# EAGLE design SPY SCH (EAGLE 8.7.0)

## Sheet 1 of 2
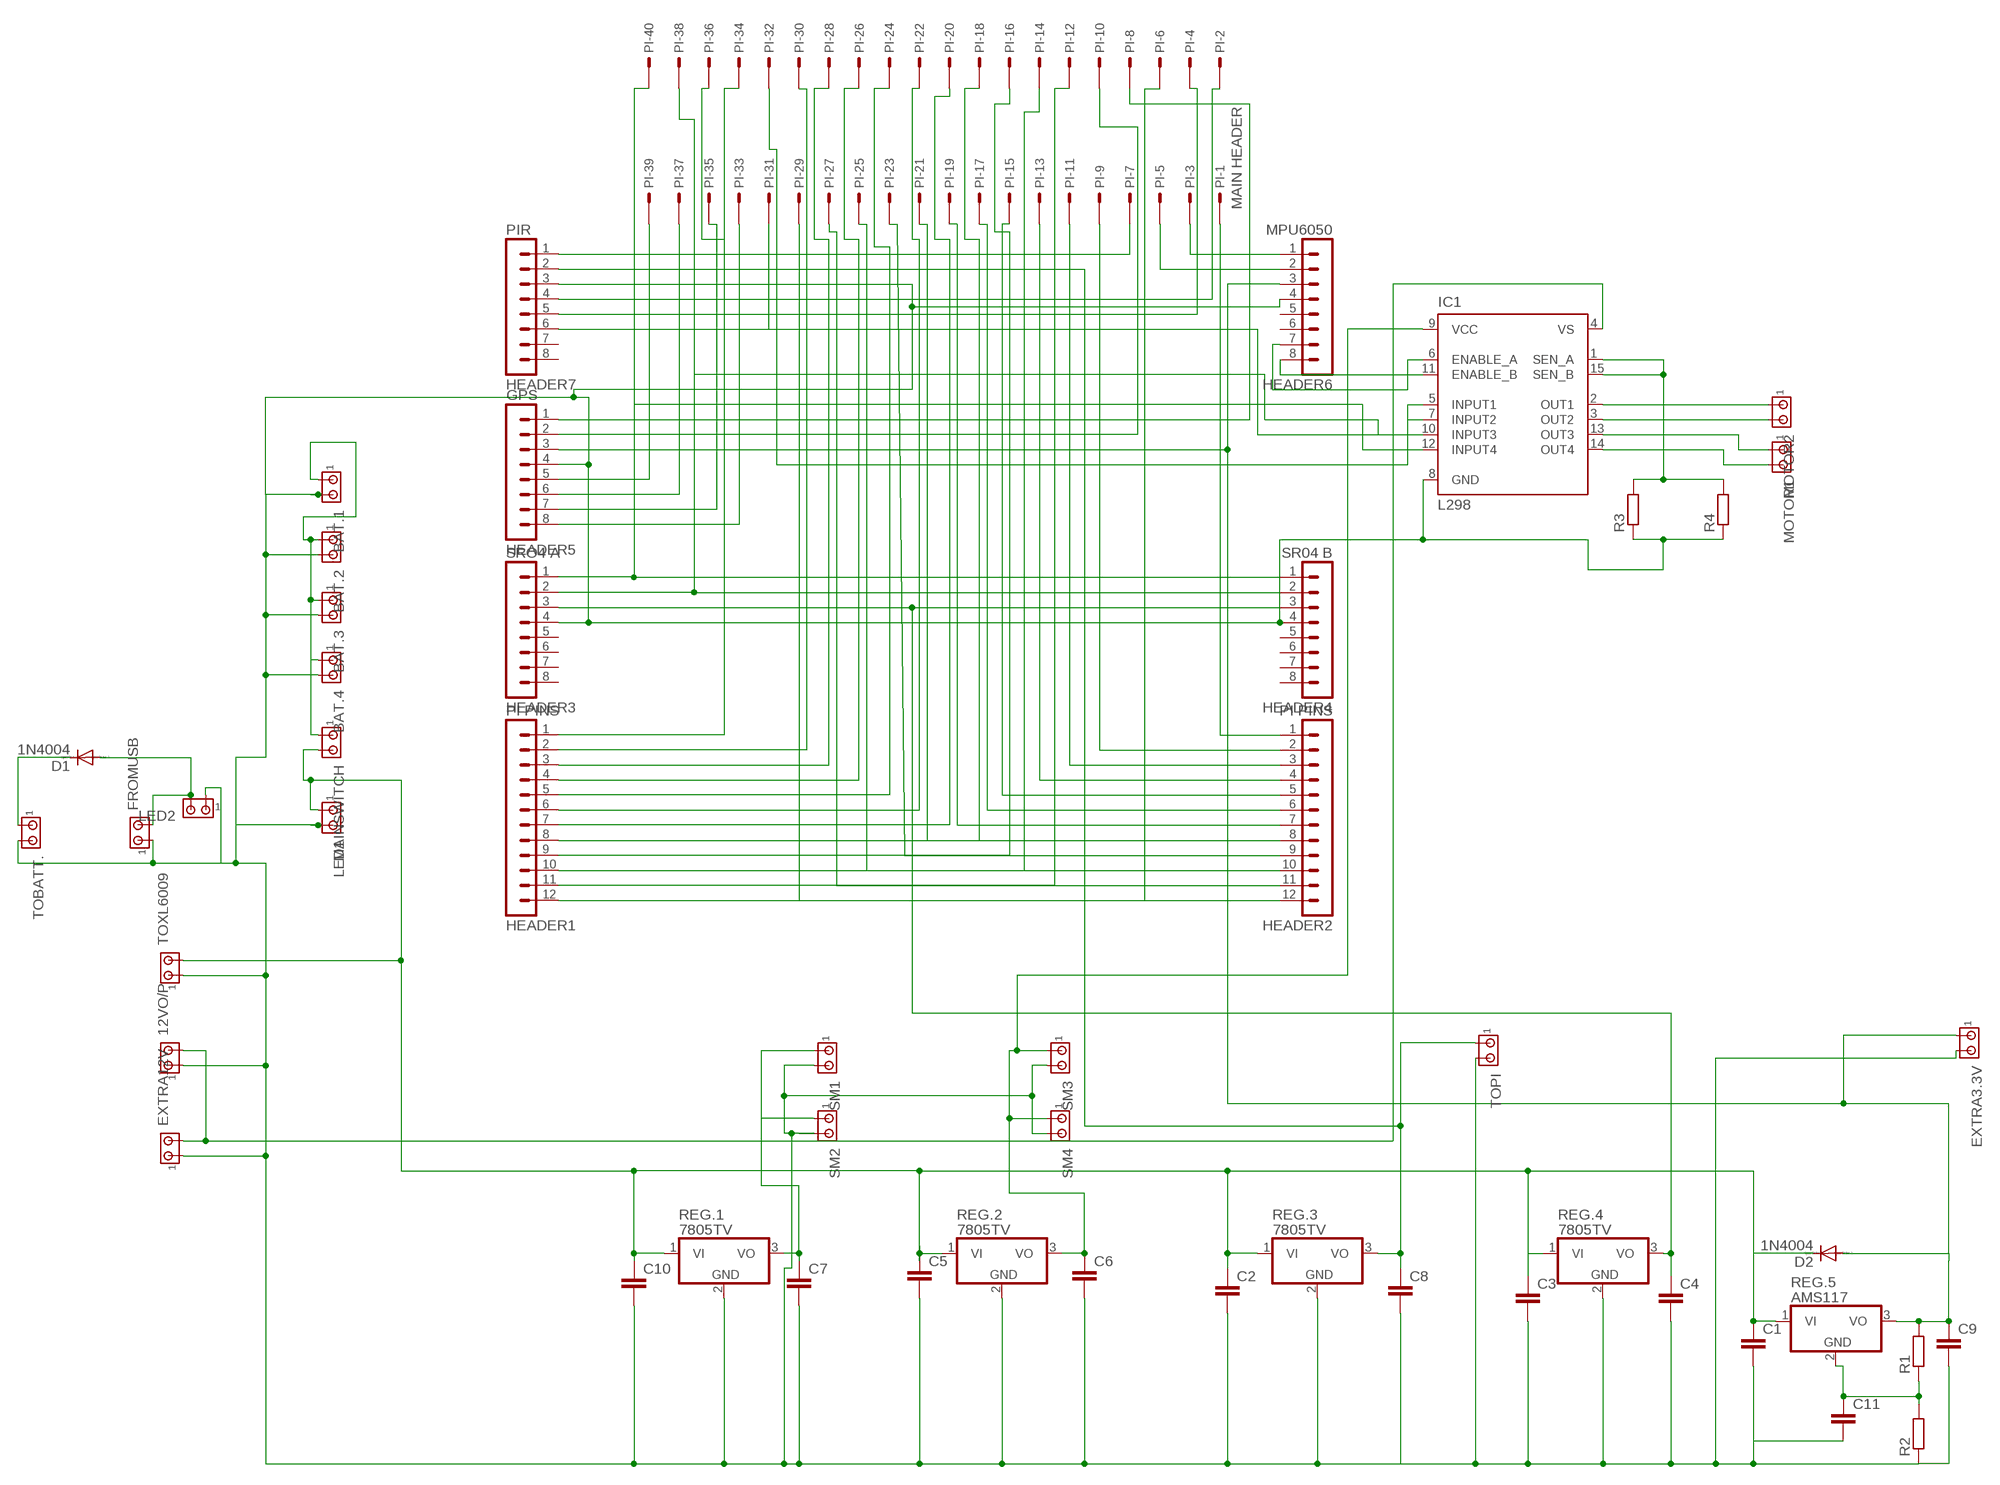
[diagram p0: schematic, sheet 1]

### Parts
12VO/P  MTA02-156  [1X2MTA]
BAT.1  MTA02-156  [1X2MTA]
BAT.2  MTA02-156  [1X2MTA]
BAT.3  MTA02-156  [1X2MTA]
BAT.4  MTA02-156  [1X2MTA]
C1  C2,5-3  [C2.5-3]
C2  C2,5-3  [C2.5-3]
C3  C2,5-3  [C2.5-3]
C4  C2,5-3  [C2.5-3]
C5  C2,5-3  [C2.5-3]
C6  C2,5-3  [C2.5-3]
C7  C2,5-3  [C2.5-3]
C8  C2,5-3  [C2.5-3]
C9  C2,5-3  [C2.5-3]
C10  C2,5-3  [C2.5-3]
C11  C2,5-3  [C2.5-3]
D1  1N4004  [DO41-10]
D2  1N4004  [DO41-10]
EXTRA3.3V  MTA02-156  [1X2MTA]
EXTRA12V  MTA02-156  [1X2MTA]
FROMUSB  MTA02-156  [1X2MTA]
HEADER1  PI PINS  MA12-1W  [MA12-1W]
HEADER2  PI PINS  MA12-1W  [MA12-1W]
HEADER3  SRO4 A  MA08-1  [MA08-1]
HEADER4  SR04 B  MA08-1  [MA08-1]
HEADER5  GPS  MA08-1  [MA08-1]
HEADER6  MPU6050  MA08-1  [MA08-1]
HEADER7  PIR  MA08-1  [MA08-1]
IC1  L298  [MULTIWATT-15]
LED1  MTA02-156  [1X2MTA]
LED2  MTA02-156  [1X2MTA]
MAINSWITCH  MTA02-156  [1X2MTA]
MOTOR1  MTA02-156  [1X2MTA]
MOTOR2  MTA02-156  [1X2MTA]
PI  MAIN HEADER  057-040-1  [057-040-1]
R1  R-EU_0309/12  [0309/12]
R2  R-EU_0309/12  [0309/12]
R3  R-EU_0309/12  [0309/12]
R4  R-EU_0309/12  [0309/12]
REG.1  7805TV  [TO220V]
REG.2  7805TV  [TO220V]
REG.3  7805TV  [TO220V]
REG.4  7805TV  [TO220V]
REG.5  AMS117  7805TV  [TO220V]
SM1  MTA02-156  [1X2MTA]
SM2  MTA02-156  [1X2MTA]
SM3  MTA02-156  [1X2MTA]
SM4  MTA02-156  [1X2MTA]
TOBATT.  MTA02-156  [1X2MTA]
TOPI  MTA02-156  [1X2MTA]
TOXL6009  MTA02-156  [1X2MTA]

### Nets
N$1: HEADER7.1 PI.7
N$2: HEADER7.4 PI.2
N$3: D1.C TOBATT..1
N$4: D1.A FROMUSB.2 LED2.2
N$5: HEADER5.1 PI.8
N$6: HEADER6.2 PI.5
N$8: C8.1 HEADER7.2 REG.3.3(VO) TOPI.1
N$9: C6.1 IC1.9(VCC) REG.2.3(VO) SM3.1 SM4.1
N$10: HEADER5.2 PI.10
N$11: HEADER3.2 HEADER4.2 IC1.10(INPUT3) PI.38
N$12: IC1.7(INPUT2) PI.36
N$13: HEADER3.1 HEADER4.1 IC1.12(INPUT4) PI.40
N$14: HEADER6.1 PI.3
N$15: C1.1 C2.1 C3.1 C5.1 C10.1 D2.C LED1.1 MAINSWITCH.2 REG.1.1(VI) REG.2.1(VI) REG.3.1(VI) REG.4.1(VI) REG.5.1(VI) TOXL6009.2
N$16: BAT.1.1 BAT.2.1 BAT.3.1 BAT.4.1 MAINSWITCH.1
N$17: C9.1 D2.A EXTRA3.3V.1 HEADER5.3 HEADER6.3 R1.2 REG.5.3(VO)
N$18: HEADER1.1 PI.34
N$19: C4.1 HEADER3.3 HEADER4.3 REG.4.3(VO)
N$20: C7.1 REG.1.3(VO) SM1.1 SM2.1
N$21: IC1.5(INPUT1) PI.32
N$22: 12VO/P.2 EXTRA12V.2 IC1.4(VS)
N$23: HEADER1.7 PI.20
N$24: HEADER1.2 PI.30
N$25: HEADER1.3 PI.28
N$26: HEADER1.4 PI.26
N$27: HEADER1.5 PI.24
N$28: HEADER1.6 PI.22
N$29: HEADER1.8 PI.18
N$30: HEADER1.9 PI.16
N$31: HEADER1.10 PI.14
N$32: HEADER1.11 PI.12
N$33: HEADER1.12 PI.6
N$34: HEADER2.1 PI.1
N$35: HEADER2.2 PI.9
N$36: HEADER2.3 PI.11
N$37: HEADER2.4 PI.13
N$38: HEADER2.5 PI.15
N$39: HEADER2.7 PI.19
N$40: HEADER2.8 PI.21
N$41: HEADER2.9 PI.23
N$42: HEADER2.6 PI.17
N$43: HEADER2.10 PI.25
N$44: HEADER2.11 PI.27
N$45: HEADER2.12 PI.29
N$46: HEADER7.5 PI.4
N$47: HEADER6.8 IC1.11(ENABLE_B)
N$48: HEADER7.6 PI.31
N$49: HEADER5.5 PI.39
N$50: HEADER5.6 PI.37
N$51: HEADER5.7 PI.35
N$52: HEADER5.8 PI.33
N$53: C11.1 R1.1 R2.2 REG.5.2(GND)
N$54: 12VO/P.1 BAT.1.2 BAT.2.2 BAT.3.2 BAT.4.2 C1.2 C2.2 C3.2 C4.2 C5.2 C6.2 C7.2 C8.2 C9.2 C10.2 C11.2 EXTRA3.3V.2 EXTRA12V.1 FROMUSB.1 HEADER3.4 HEADER4.4 HEADER5.4 HEADER6.4 HEADER7.3 IC1.8(GND) LED1.2 LED2.1 R2.1 R3.1 R4.1 REG.1.2(GND) REG.2.2(GND) REG.3.2(GND) REG.4.2(GND) SM1.2 SM2.2 SM3.2 SM4.2 TOBATT..2 TOPI.2 TOXL6009.1
N$55: IC1.1(SEN_A) IC1.15(SEN_B) R3.2 R4.2
N$57: IC1.2(OUT1) MOTOR2.1
N$58: IC1.3(OUT2) MOTOR2.2
N$59: IC1.13(OUT3) MOTOR1.1
N$60: IC1.14(OUT4) MOTOR1.2
N$61: HEADER6.7 IC1.6(ENABLE_A)
Unconnected: HEADER3.5 HEADER3.6 HEADER3.7 HEADER3.8 HEADER4.5 HEADER4.6 HEADER4.7 HEADER4.8 HEADER6.5 HEADER6.6 HEADER7.7 HEADER7.8

## Sheet 2 of 2

## Library data of the parts
12VO/P BAT.1-BAT.4 EXTRA3.3V EXTRA12V FROMUSB LED1 LED2 MAINSWITCH MOTOR1 MOTOR2 SM1-SM4 TOBATT. TOPI TOXL6009 = con-amp:MTA02-156: AMP connector
C1-C11 = capacitor-wima:C: CAPACITOR naming: grid - package width
D1 D2 = diode:1N4004: DIODE general purpose rectifier, 1 A
HEADER1 HEADER2 = con-lstb:MA12-1W: PIN HEADER; OC_FARNELL: unknown; OC_NEWARK: unknown
HEADER3-HEADER7 = con-lstb:MA08-1: PIN HEADER; OC_FARNELL: unknown; OC_NEWARK: unknown
IC1 = st-microelectronics:L298: DUAL FULL-BRIDGE DRIVER; MPN: L298N; OC_FARNELL: 1589425; OC_NEWARK: 32M1527
PI = con-panduit:057-040-: CONNECTOR 40-pin series 057 contact pc board low profile headers; OC_FARNELL: unknown; OC_NEWARK: unknown
R1-R4 = resistor:R-EU_: RESISTOR, European symbol
REG.1-REG.5 = linear:78*: Positive VOLTAGE REGULATOR Source: http://cache.national.com/ds/LM/LM78L05.pdf http://www.fairchildsemi.com/ds/LM/LM7805.pdf

## Board
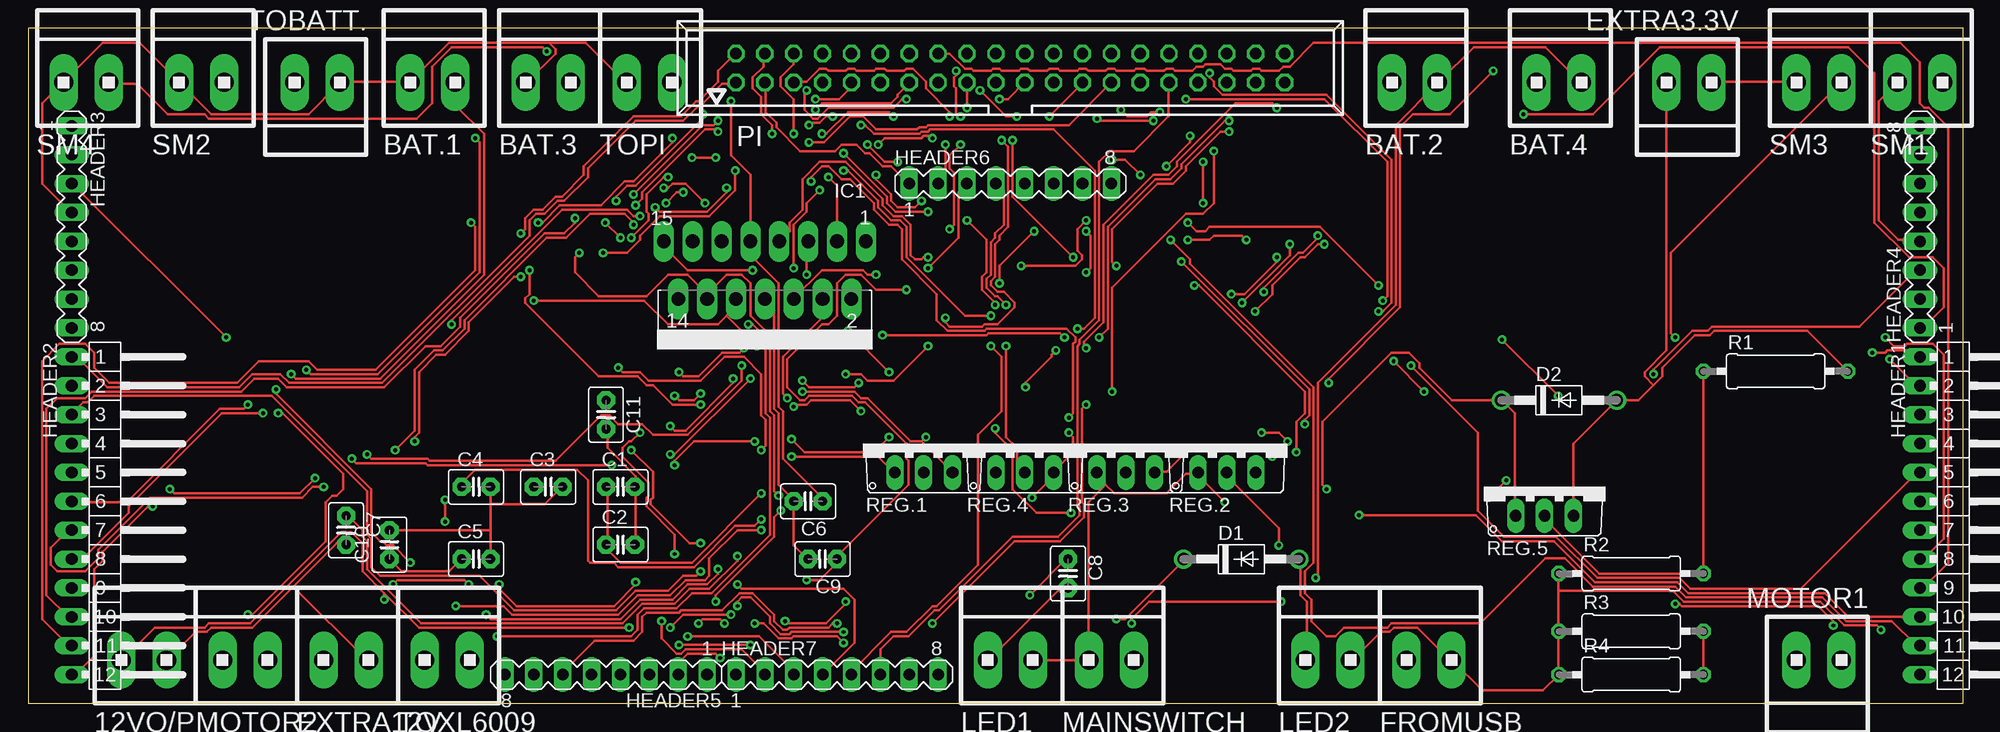
[diagram p1: board, top side]
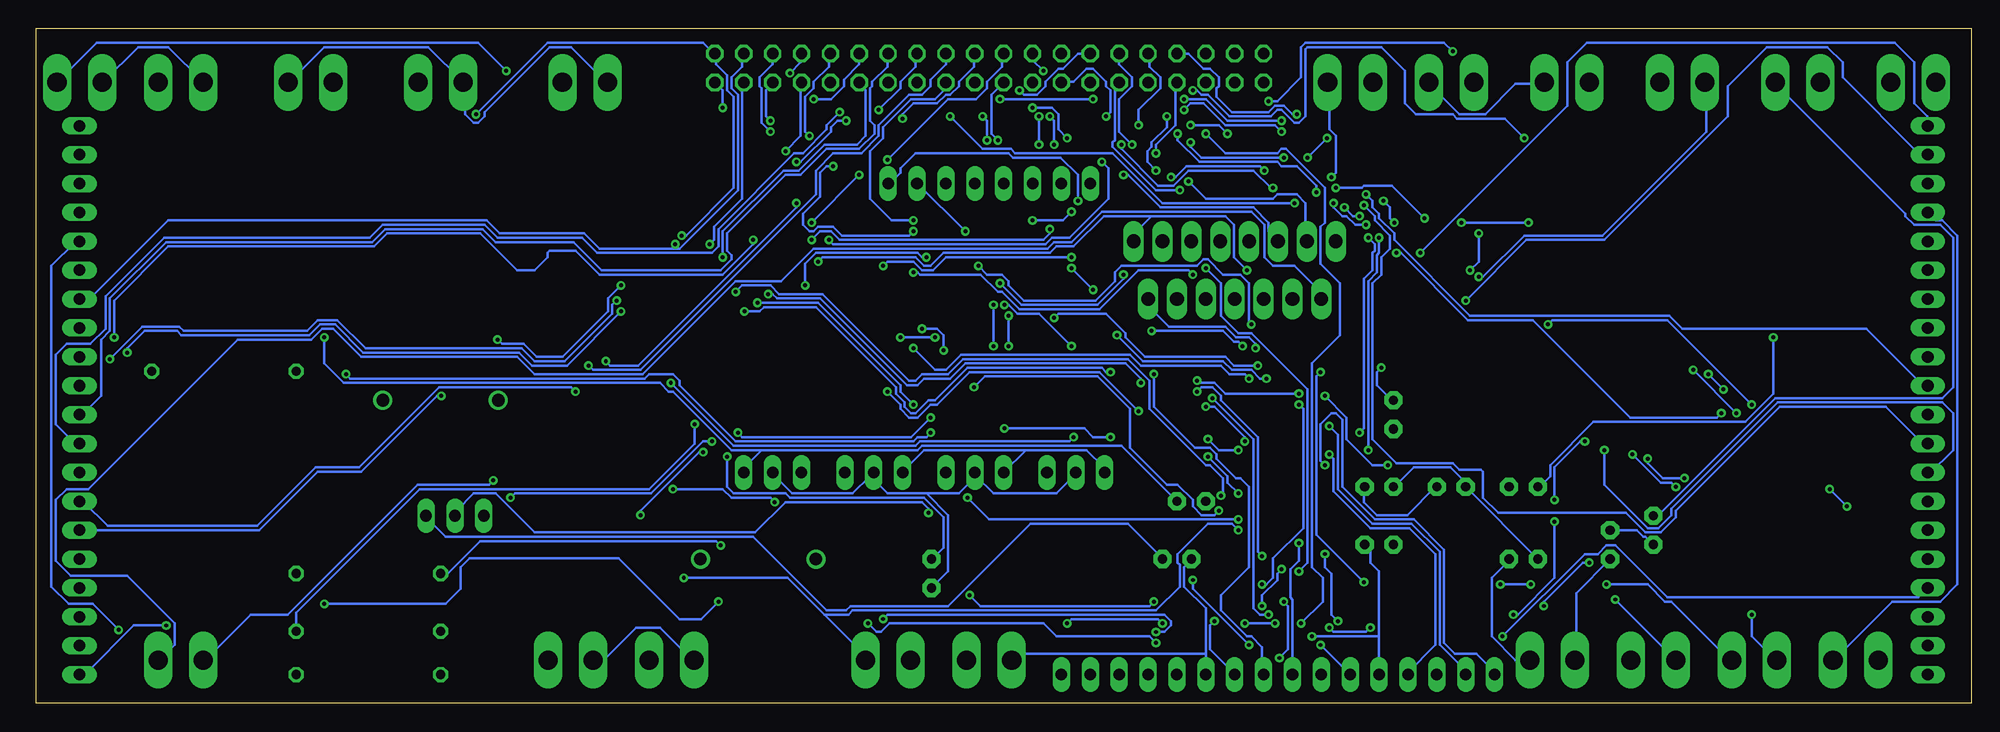
[diagram p2: board, bottom side, seen from below]

Size 170.16 x 59.36 mm. Coordinates in mm from the lower left corner, seen from the top.
Outline: 0,0 170.16,0 170.16,59.36 0,59.36 0,0
Copper layers (1*16): Top 0.035mm / dielectric 1.5mm / Bottom 0.035mm
Design rules "default *": minimum track width 9mil, minimum drill 0.35mm, track to track 6mil, track to pad 6mil, pad to pad 6mil, via to via 6mil, smd to smd 6mil, copper to edge 40mil, drill to drill 6mil, minimum pad ring 10mil, minimum via ring 8mil, stop-mask expansion 4mil, vias tented up to drill 0mil, thermal gap 10mil

### Footprints (pad centres in the part's own frame; a part is rotated, then mirrored left to right if it is on the bottom)
1X2MTA = drill 1.676 long: 1 1.981,0; 2 -1.981,0
C2.5-3 = drill 0.813 pad 1.6 octagon: 1 -1.27,0; 2 1.27,0
DO41-10 = drill 1.118: A 5.08,0; C -5.08,0
MA12-1W = drill 1.016 long: 1 -13.97,0; 2 -11.43,0; 3 -8.89,0; 4 -6.35,0; 5 -3.81,0; 6 -1.27,0; 7 1.27,0; 8 3.81,0; 9 6.35,0; 10 8.89,0; 11 11.43,0; 12 13.97,0
MA08-1 = drill 1.016 long: 1 -8.89,0; 2 -6.35,0; 3 -3.81,0; 4 -1.27,0; 5 1.27,0; 6 3.81,0; 7 6.35,0; 8 8.89,0
MULTIWATT-15 = drill 1.2 long: 1 -8.89,-7.62; 2 -7.62,-2.54; 3 -6.35,-7.62; 4 -5.08,-2.54; 5 -3.81,-7.62; 6 -2.54,-2.54; 7 -1.27,-7.62; 8 0,-2.54; 9 1.27,-7.62; 10 2.54,-2.54; 11 3.81,-7.62; 12 5.08,-2.54; 13 6.35,-7.62; 14 7.62,-2.54; 15 8.89,-7.62
057-040-1 = drill 1 octagon: 1 -24.13,-1.27; 2 -24.13,1.27; 3 -21.59,-1.27; 4 -21.59,1.27; 5 -19.05,-1.27; 6 -19.05,1.27; 7 -16.51,-1.27; 8 -16.51,1.27; 9 -13.97,-1.27; 10 -13.97,1.27; 11 -11.43,-1.27; 12 -11.43,1.27; 13 -8.89,-1.27; 14 -8.89,1.27; 15 -6.35,-1.27; 16 -6.35,1.27; 17 -3.81,-1.27; 18 -3.81,1.27; 19 -1.27,-1.27; 20 -1.27,1.27; 21 1.27,-1.27; 22 1.27,1.27; 23 3.81,-1.27; 24 3.81,1.27; 25 6.35,-1.27; 26 6.35,1.27; 27 8.89,-1.27; 28 8.89,1.27; 29 11.43,-1.27; 30 11.43,1.27; 31 13.97,-1.27; 32 13.97,1.27; 33 16.51,-1.27; 34 16.51,1.27; 35 19.05,-1.27; 36 19.05,1.27; 37 21.59,-1.27; 38 21.59,1.27; 39 24.13,-1.27; 40 24.13,1.27
0309/12 = drill 0.813 octagon: 1 -6.35,0; 2 6.35,0
TO220V = drill 1.016 long: 1 -2.54,-2.54; 2 0,-2.54; 3 2.54,-2.54

### Placement (x,y rotation side)
12VO/P  10.16,3.81 0 top
BAT.1  35.56,54.61 0 top
BAT.2  121.92,54.61 0 top
BAT.3  45.72,54.61 0 top
BAT.4  134.62,54.61 0 top
C1  52.07,19.05 0 top
C2  52.07,13.97 0 top
C3  45.72,19.05 0 top
C4  39.37,19.05 0 top
C5  39.37,12.7 0 top
C6  68.58,17.78 180 top
C7  27.94,15.24 270 top
C8  91.44,11.43 270 top
C9  69.85,12.7 180 top
C10  31.75,13.97 90 top
C11  50.8,25.4 270 top
D1  106.68,12.7 0 top
D2  134.62,26.67 0 top
EXTRA3.3V  146.05,54.61 180 top
EXTRA12V  27.94,3.81 0 top
FROMUSB  123.19,3.81 0 top
HEADER1  166.37,16.51 270 top
HEADER2  3.81,16.51 270 top
HEADER3  3.81,41.91 270 top
HEADER4  166.37,41.91 90 top
HEADER5  50.8,2.54 180 top
HEADER6  86.36,45.72 0 top
HEADER7  71.12,2.54 0 top
IC1  64.77,33.02 180 top
LED1  86.36,3.81 0 top
LED2  114.3,3.81 0 top
MAINSWITCH  95.25,3.81 0 top
MOTOR1  157.48,3.81 180 top
MOTOR2  19.05,3.81 0 top
PI  86.36,55.88 0 top
R1  153.67,29.21 0 top
R2  140.97,11.43 0 top
R3  140.97,6.35 0 top
R4  140.97,2.54 0 top
REG.1  78.74,22.86 0 top
REG.2  105.41,22.86 0 top
REG.3  96.52,22.86 0 top
REG.4  87.63,22.86 0 top
REG.5  133.35,19.05 0 top
SM1  166.37,54.61 0 top
SM2  15.24,54.61 0 top
SM3  157.48,54.61 0 top
SM4  5.08,54.61 0 top
TOBATT.  25.4,54.61 180 top
TOPI  54.61,54.61 0 top
TOXL6009  36.83,3.81 0 top

### Tracks (layer width: path | path; a pad name or v marks a point on that pad's centre or on a via)
N$1  (via drill 0.35)
  Top 0.229: v71.69,48.39 75.5,44.58 75.5,44.01 76.26,43.24 v79.12,43.24 | v82.55,42.48 84.27,40.77 84.27,37.91 83.88,37.53 83.88,36.39 85.03,35.24 v85.03,35.05 | v79.12,31.43 76.07,28.38 73.79,28.38 73.22,28.96 v71.88,28.96
  Bottom 0.229: v71.69,48.39 71.69,49.15 69.98,50.86 69.98,54.48 PI.7 | v79.12,43.24 79.88,42.48 v82.55,42.48 | v85.03,35.05 84.65,35.05 83.88,34.29 81.98,34.29 v79.12,31.43 | v71.88,28.96 71.88,26.1 68.26,22.48 66.93,22.48 66.36,21.91 66.36,21.53 64.64,19.81 64.26,19.81 63.5,19.05 63.5,12 65.98,9.53 65.98,8.19 63.69,5.91 63.31,5.91 62.36,4.95 62.36,2.67 HEADER7.1
N$2  (via drill 0.35)
  Top 0.229: v43.31,41.34 43.69,41.72 43.69,42.67 44.45,43.43 45.21,43.43 46.36,44.58 46.93,44.58 48.83,46.48 48.83,47.24 53.21,51.63 57.4,51.63 58.74,52.96 58.93,52.96 60.64,54.67 60.64,55.63 62.17,57.15 PI.2 | v44.07,38.1 44.07,36.01 43.69,35.62 43.69,35.24 50.17,28.77 53.59,28.77 54.36,28 54.93,28 56.64,26.29 v59.12,26.29 | v62.36,10.48 62.74,10.1 71.69,10.1 72.64,9.14 72.64,5.33 HEADER7.4
  Bottom 0.229: v43.31,41.34 43.31,38.86 v44.07,38.1 | v59.12,26.29 58.74,25.91 58.74,15.43 61.41,12.76 61.41,11.05 61.98,10.48 v62.36,10.48
N$3  (via drill 0.35)
  Top 0.229: v95.69,7.43 96.46,7.43 101.6,12.57 D1.C | v71.69,6.29 67.12,6.29 66.93,6.1 66.17,6.1 65.21,7.05 65.21,7.62 63.5,9.34 62.74,9.34 62.36,8.95 v62.36,8.57 | v60.64,11.81 60.64,11.43 59.69,10.48 57.98,10.48 56.64,9.14 53.78,9.14 52.07,7.43 40.64,7.43 v40.26,7.81 | v36.64,17.91 v36.64,16 | v33.97,23.05 33.97,23.43 34.35,23.81 34.35,29.15 35.88,30.67 36.64,30.67 38.73,32.77 38.73,33.53 42.73,37.53 v43.31,37.53
  Bottom 0.229: v95.69,7.43 95.31,7.81 70.93,7.81 70.36,7.24 70.36,6.86 70.93,6.29 v71.69,6.29 | v62.36,8.57 62.36,9.53 61.02,10.86 61.02,11.43 v60.64,11.81 | v40.26,7.81 39.88,7.81 36.64,11.05 v36.64,16 | v36.64,17.91 36.64,20.77 34.35,23.05 v33.97,23.05 | v43.31,37.53 42.93,37.53 39.31,41.15 32.45,41.15 23.3,50.29 23.3,54.48 TOBATT..1
N$4
  Top 0.229: D1.A 111.89,12.57 111.89,9.53 112.46,8.95 112.46,3.81 LED2.2
  Bottom 0.229: FROMUSB.2 120.27,3.81 117.41,6.67 115.32,6.67 112.46,3.81 LED2.2
N$5  (via drill 0.35)
  Top 0.229: v59.31,51.82 59.31,51.44 53.4,45.53 52.64,45.53 51.69,44.58 v51.69,44.2 | v52.07,40.96 v50.74,42.29 | v53.02,22.29 54.93,20.38 54.93,18.1 54.74,17.91 54.74,17.53 58.17,14.1 v59.12,14.1
  Bottom 0.229: PI.8 68.83,57.15 67.5,55.82 66.93,55.82 66.17,55.05 66.17,54.29 66.36,54.1 66.36,53.34 65.02,52.01 61.79,52.01 61.21,52.58 60.45,52.58 59.69,51.82 v59.31,51.82 | v51.69,44.2 51.12,43.62 51.12,42.67 v50.74,42.29 | v52.07,40.96 52.07,39.62 52.26,39.43 52.26,37.91 53.02,37.15 v53.02,22.29 | v59.12,14.1 59.12,12.57 59.88,11.81 59.88,9.34 59.69,9.14 HEADER5.1
N$6  (via drill 0.35)
  Top 0.229: v81.03,51.63 81.03,52.01 78.93,54.1 78.93,54.67 77.79,55.82 77.22,55.82 77.02,55.63 75.5,55.63 75.31,55.82 74.55,55.82 74.36,55.63 72.83,55.63 72.64,55.82 72.07,55.82 71.88,55.63 70.36,55.63 70.17,55.82 69.6,55.82 68.45,54.67 67.31,54.67 PI.5 | v80.64,49.15 80.64,46.29 80.07,45.72 HEADER6.2
  Bottom 0.229: v81.03,51.63 80.64,51.24 v80.64,49.15
N$8  (via drill 0.35)
  Top 0.229: v66.55,7.24 66.74,7.05 70.17,7.05 71.88,8.76 v71.88,8.95 | v88.08,9.53 91.31,12.76 C8.1 | v109.41,21.72 108.84,22.29 101.98,22.29 100.08,20.38 99.12,20.38 REG.3.3 | v56.26,46.29 55.88,46.29 54.36,44.77 54.36,43.24 54.55,43.05 54.55,42.48 v53.02,40.96 | v53.78,23.81 53.02,23.05 52.83,23.05 52.26,22.48 52.26,21.72 54.55,19.43 54.55,18.29 54.36,18.1 54.36,17.34 56.83,14.86 v56.83,13.14 | v55.69,7.24 55.69,5.71 57.02,4.38 57.4,4.38 57.78,4.76 62.74,4.76 64.83,2.67 HEADER7.2
  Bottom 0.229: v66.55,7.24 66.93,6.86 66.93,4.76 64.83,2.67 HEADER7.2 | v71.88,8.95 72.26,8.57 87.12,8.57 v88.08,9.53 | v109.41,21.72 109.41,19.05 108.84,18.48 104.27,18.48 103.89,18.1 92.08,18.1 90.36,16.38 90.36,13.72 91.31,12.76 C8.1 | v56.26,46.29 55.88,46.67 55.88,49.91 56.45,50.48 56.45,54.48 TOPI.1 | v53.02,40.96 52.45,40.39 52.45,39.81 52.64,39.62 52.64,38.1 53.4,37.34 53.4,24.19 v53.78,23.81 | v56.83,13.14 56.83,12 56.26,11.43 56.26,7.81 v55.69,7.24
N$9  (via drill 0.35)
  Top 0.229: C6.1 69.98,17.91 66.36,21.53 66.36,25.72 65.98,26.1 65.98,36.96 63.5,39.43 IC1.9 63.5,46.48 61.79,48.2 v61.79,52.96 | v45.59,57.34 45.21,57.72 37.21,57.72 35.5,56.01 35.5,52.77 34.16,51.44 15.88,51.44 15.49,51.82 12.26,51.82 9.59,54.48 7.11,54.48 SM4.1 | v144.84,32.19 144.46,32.58 144.46,39.62 159.32,54.48 SM3.1
  Bottom 0.229: 106.36,22.29 107.89,20.77 107.89,20.38 REG.2.3 | 106.36,22.29 92.65,22.29 92.27,22.67 74.74,22.67 C6.1 | v45.59,57.34 46.36,58.1 58.55,58.1 58.93,57.72 58.93,55.05 61.02,52.96 v61.79,52.96 | v144.84,32.19 144.84,29.91 143.13,28.19 115.32,28.19 114.55,27.43 114.17,27.43 109.03,22.29 106.36,22.29
N$10  (via drill 0.35)
  Top 0.229: v73.22,50.86 73.6,50.86 74.36,50.1 78.36,50.1 78.55,50.29 79.12,50.29 79.31,50.48 90.17,50.48 93.79,46.86 93.79,33.91 92.84,32.96 v92.27,32.96 | v90.36,31.05 89.98,30.67 89.98,30.48 87.69,28.19 v87.69,27.81 | v66.17,16.95 65.59,16.38 65.59,14.67 60.45,9.53 v60.45,8.95 | v60.83,4 60.45,4.38 57.98,4.38 57.21,3.62 57.21,2.67 HEADER5.2
  Bottom 0.229: v73.22,50.86 73.22,52.2 71.31,54.1 71.31,55.05 72.26,56.01 72.26,57.15 PI.10 | v92.27,32.96 90.93,32.96 90.36,32.38 v90.36,31.05 | v87.69,27.81 86.74,28.77 76.83,28.77 73.98,25.91 73.98,22.48 70.74,19.24 69.79,19.24 68.45,17.91 68.45,17.34 67.69,16.57 66.55,16.57 v66.17,16.95 | v60.45,8.95 60.07,8.57 60.07,4.76 v60.83,4
N$11  (via drill 0.35)
  Top 0.229: v44.45,35.43 54.17,35.43 56.26,33.34 60.64,33.34 61.41,34.1 | 61.41,34.1 62.17,34.86 62.17,35.43 IC1.10 | v64.07,31.43 61.41,34.1 | v75.69,29.15 v72.07,32.77 | v107.89,34.48 109.41,36.01 109.41,36.77 111.89,39.24 112.27,39.24 113.41,40.39 v113.98,40.39
  Bottom 0.229: v44.45,35.43 39.12,40.77 32.26,40.77 21.4,51.63 21.4,54.29 17.97,57.72 12.64,57.72 11.3,56.39 11.3,55.05 4.64,48.39 3.87,48.39 HEADER3.2 | 113.98,40.01 120.65,40.01 121.98,41.34 129.41,41.34 130.56,42.48 158.56,42.48 165.42,35.62 166.37,35.62 HEADER4.2 | 113.98,40.01 113.6,40.01 108.46,45.15 108.46,53.53 109.03,54.1 109.03,55.05 108.08,56.01 108.08,57.15 PI.38 | v64.07,31.43 64.45,31.81 64.83,31.81 65.79,32.77 v72.07,32.77 | v75.69,29.15 76.07,29.15 76.45,29.53 88.27,29.53 91.12,26.67 91.69,26.67 92.84,25.53 93.22,25.53 93.79,26.1 93.79,26.48 94.55,27.24 94.55,27.81 101.6,34.86 106.17,34.86 106.55,34.48 v107.89,34.48 | 113.98,40.01 v113.98,40.39
N$12  (via drill 0.35)
  Top 0.229: v105.6,50.29 104.84,50.29 101.79,47.24 101.79,46.86 100.65,45.72 99.31,45.72 95.31,41.72 95.31,38.86 v95.69,38.48 | v79.12,39.24 78.74,39.24 78.55,39.05 77.98,39.05 77.6,39.43 77.6,42.1 76.83,42.86 76.07,42.86 75.12,43.81 75.12,44.39 71.88,47.62 69.6,47.62 68.07,46.1 68.07,43.43 66.93,42.29 66.93,41.53 IC1.7
  Bottom 0.229: PI.36 105.41,56.2 106.55,55.05 106.55,54.29 106.36,54.1 106.36,51.05 v105.6,50.29 | v95.69,38.48 95.31,38.86 93.03,38.86 92.27,38.1 91.31,38.1 90.17,39.24 v79.12,39.24
N$13  (via drill 0.35)
  Top 0.229: v48.45,39.62 48.07,39.24 48.07,37.91 50.17,35.81 54.36,35.81 56.26,37.72 57.98,37.72 59.69,36.01 | 59.69,36.01 IC1.12 59.69,35.62 | v131.51,51.82 137.6,51.82 143.51,57.72 160.08,57.72 162.37,55.44 162.37,42.29 165.42,39.24 167.51,39.24 168.47,38.29 168.47,34.86 166.75,33.15 166.37,33.15 HEADER4.1 | 59.69,36.01 61.41,37.72 62.74,37.72 63.5,36.96 63.5,34.1 65.21,32.38 65.21,25.72 65.59,25.34 65.59,18.67 v65.98,18.29 | v108.65,36.2 108.65,36.58 111.7,39.62 112.08,39.62 113.41,40.96 v113.41,41.15
  Bottom 0.229: v48.45,39.62 35.5,52.58 35.5,56.39 33.78,58.1 6.73,58.1 5.02,56.39 5.02,52.77 3.87,51.63 3.87,50.86 HEADER3.1 | v131.51,51.82 125.22,58.1 111.51,58.1 110.55,57.15 PI.40 110.36,57.15 110.36,56.2 109.41,55.24 109.41,53.91 108.84,53.34 108.84,45.34 113.03,41.15 v113.41,41.15 | v65.98,18.29 65.79,18.48 65.79,19.81 66.93,20.95 67.31,20.95 72.26,25.91 72.26,28.38 74.17,30.29 88.65,30.29 89.98,28.96 92.27,28.96 92.84,28.38 93.41,28.38 101.03,36.01 104.84,36.01 105.6,36.77 108.08,36.77 v108.65,36.2
N$14
  Top 0.229: PI.3 64.83,54.48 64.83,52.01 65.79,51.05 65.79,50.67 67.88,48.58 70.93,48.58 71.5,49.15 72.83,49.15 73.6,48.39 73.98,48.39 75.12,47.24 75.88,47.24 77.41,45.72 HEADER6.1
N$15  (via drill 0.35)
  Top 0.229: C1.1 50.93,19.05 50.93,14.1 C2.1 50.93,13.91 50.93,13.53 52.07,12.38 58.36,12.38 v64.45,18.48 | C10.1 32.83,11.62 37.02,11.62 C5.1 | REG.5.1 130.75,16.57 130.75,25.53 129.6,26.67 D2.C 125.22,26.67 122.36,29.53 122.36,29.91 121.41,30.86 119.89,30.86 113.79,24.77 113.79,19.24 v114.17,18.86 | 93.22,3.81 LED1.1 | 102.74,20.19 101.79,20.19 100.08,18.48 95.5,18.48 94.74,19.24 | 94.74,19.24 93.98,20 REG.3.1 | 93.22,3.81 93.22,17.72 94.74,19.24 | 93.22,3.81 MAINSWITCH.2 | 102.74,20.19 v105.22,17.72 | 102.74,20.19 REG.2.1 | v67.12,21.72 74.74,21.72 76.07,20.38 REG.1.1
  Bottom 0.229: C1.1 50.74,19.05 49.02,20.77 45.78,20.77 44.45,19.43 C3.1 C5.1 | C10.1 34.73,9.72 34.73,3.81 TOXL6009.2 | 83.12,22.29 77.79,22.29 76.26,20.77 76.26,20.38 REG.1.1 | REG.4.1 83.12,22.29 | 83.12,22.29 92.08,22.29 93.98,20.38 REG.3.1 | v114.17,18.86 109.79,18.86 109.03,18.1 105.6,18.1 v105.22,17.72 | v64.45,18.48 65.41,19.43 65.41,20 v67.12,21.72
N$16  (via drill 0.35)
  Top 0.229: v113.22,11.05 113.41,11.24 113.41,28.19 120.27,35.05 120.27,50.86 123.89,54.48 BAT.2.1 124.08,54.67 127.13,57.72 133.41,57.72 136.46,54.67 BAT.4.1 | v23.11,28.96 23.5,28.57 30.93,28.57 40.07,37.72 40.07,50.1 37.59,52.58 37.59,54.48 BAT.1.1 | v21.78,27.62 21.78,27.24 30.16,18.86 30.16,15.05 30.93,14.29 31.11,14.29 31.5,13.91 32.07,13.91 v33.59,12.38 | v37.59,8.57 41.78,8.57 42.55,7.81 51.88,7.81 53.59,9.53 56.45,9.53 57.78,10.86 59.5,10.86 59.88,11.24 59.88,12.76 62.36,15.24 v64.45,15.24
  Bottom 0.229: BAT.1.1 37.59,54.48 40.07,54.48 42.73,51.82 45.02,51.82 47.69,54.48 BAT.3.1 | 100.84,7.81 104.08,11.05 v113.22,11.05 | 100.84,7.81 97.41,4.38 97.41,3.81 MAINSWITCH.1 | v21.78,27.62 v23.11,28.96 | v33.59,12.38 34.16,12.38 37.59,8.95 v37.59,8.57 | v64.45,15.24 65.02,15.81 67.12,15.81 69.79,13.14 69.79,12.38 69.6,12.19 69.6,10.29 71.69,8.19 98.36,8.19 98.74,7.81 100.84,7.81
N$17  (via drill 0.35)
  Top 0.229: R1.2 156.46,32.77 148.27,32.77 147.89,32.38 146.56,32.38 143.7,29.53 143.7,28.77 142.94,28 | 142.94,28 141.6,26.67 D2.A 135.89,22.86 REG.5.3 | 142.94,28 142.18,28.77 142.18,29.15 144.08,31.05 144.08,54.48 EXTRA3.3V.1 | v63.5,5.14 v57.21,5.14 | v68.45,10.86 69.6,10.86 71.12,12.38 C9.1 71.12,12.95 77.41,19.24 77.41,21.34 77.22,21.53 77.22,22.86 73.6,26.48 73.03,26.48 72.45,27.05 68.64,27.05 68.26,26.67 67.88,26.67 66.74,27.81 66.74,30.29 69.79,33.34 70.36,33.34 71.12,34.1 71.12,36.96 71.88,37.72 73.22,37.72 74.55,36.39 v77.22,36.39 | HEADER6.3 81.79,44.96 81.79,40.96 v79.12,38.29
  Bottom 0.229: v57.21,5.14 HEADER5.3 | v63.5,5.14 68.45,10.1 v68.45,10.86 | v77.22,36.39 v79.12,38.29 | REG.5.3 135.89,16.38 134.18,14.67 107.12,14.67 100.65,8.19 98.93,8.19 98.55,8.57 89.98,8.57 82.74,15.81 74.17,15.81 71.12,12.76 C9.1
N$18  (via drill 0.35)
  Top 0.229: v103.89,55.44 103.89,55.05 104.27,54.67 104.27,54.29 105.03,53.53 114.17,53.53 119.89,47.82 119.89,35.24 119.13,34.48 v118.74,34.48 | v162.18,30.86 163.32,30.86 163.51,31.05 165.8,31.05 HEADER1.1
  Bottom 0.229: v103.89,55.44 102.93,56.39 102.93,57.15 PI.34 | v118.74,34.48 123.51,29.72 126.55,29.72 127.7,30.86 141.41,30.86 143.89,33.34 145.22,33.34 146.18,32.38 157.42,32.38 157.8,32.77 160.66,32.77 162.18,31.24 v162.18,30.86
N$19  (via drill 0.35)
  Top 0.229: v17.4,32.19 3.87,45.72 HEADER3.3 | v91.5,23.81 91.88,23.43 91.88,22.1 90.17,20.38 REG.4.3 90.17,20 v88.27,18.1 | v142.94,28.96 142.94,29.34 146.37,32.77 147.7,32.77 148.08,33.15 161.04,33.15 165.99,38.1 HEADER4.3 | v64.45,16.19 63.88,15.62 62.17,15.62 58.55,12 51.88,12 51.5,12.38 49.4,12.38 49.21,12.57 49.21,19.62 48.26,20.57 39.31,20.57 38.16,19.43 38.16,19.05 C4.1
  Bottom 0.229: v17.4,32.19 17.4,27.24 19.88,24.77 33.21,24.77 37.02,20.95 37.02,20 37.97,19.05 C4.1 | v91.5,23.81 91.88,23.43 92.65,23.43 93.03,23.05 108.65,23.05 113.6,28 113.6,28.38 114.17,28.96 116.27,28.96 116.65,28.57 142.56,28.57 v142.94,28.96 | v64.45,16.19 86.36,16.19 v88.27,18.1
N$20  (via drill 0.35)
  Top 0.229: 78.55,23.05 REG.1.3 | 78.55,23.05 77.6,23.05 73.79,26.86 73.22,26.86 72.64,27.43 v68.07,27.43 | v62.36,12.95 62.36,12.57 59.88,10.1 58.17,10.1 56.83,8.76 53.97,8.76 52.26,7.05 34.54,7.05 29.78,11.81 29.78,14.29 29.4,14.67 29.4,15.24 28.07,16.57 C7.1 | v128.84,55.63 125.03,51.82 121.79,51.82 120.65,50.67 120.65,34.86 114.36,28.57 v114.36,28.19 | 78.55,23.05 v78.93,23.43
  Bottom 0.229: v68.07,27.43 67.69,27.81 66.74,27.81 65.98,27.05 65.98,26.67 62.74,23.43 62.74,13.34 v62.36,12.95 | SM2.1 17.21,54.48 5.78,43.05 5.78,42.86 5.02,42.1 2.73,42.1 1.59,40.96 1.59,27.81 2.54,26.86 17.21,26.86 27.5,16.57 27.88,16.57 C7.1 | v128.84,55.63 131.32,58.1 164.85,58.1 168.28,54.67 SM1.1 | v114.36,28.19 108.84,22.67 92.84,22.67 92.46,23.05 79.31,23.05 v78.93,23.43
N$21  (via drill 0.35)
  Top 0.229: v102.17,49.91 102.17,49.34 v100.08,47.24 | v93.03,41.53 93.41,41.15 93.41,38.29 v93.03,37.91 | v68.45,37.72 68.45,40.58 IC1.5
  Bottom 0.229: v102.17,49.91 102.55,50.29 102.55,53.34 101.79,54.1 101.79,54.67 100.46,56.01 100.46,57.15 PI.32 | v100.08,47.24 100.65,47.24 101.22,46.67 101.22,44.58 102.74,43.05 102.74,42.1 102.17,41.53 101.79,41.53 101.41,41.91 100.08,41.91 99.31,41.15 93.41,41.15 v93.03,41.53 | v93.03,37.91 92.65,37.91 92.46,37.72 87.12,37.72 85.6,36.2 85.22,36.2 83.69,34.67 76.64,34.67 73.22,38.1 68.83,38.1 v68.45,37.72
N$22  (via drill 0.35)
  Top 0.229: v66.74,26.86 66.36,27.24 66.36,30.48 69.79,33.91 69.79,35.43 IC1.4 | v61.79,7.81 57.59,7.81 v56.45,6.67 | v52.83,6.67 34.35,6.67 31.3,9.72 | 31.3,9.72 29.4,11.62 29.4,14.1 28.45,15.05 27.5,15.05 19.5,7.05 15.88,7.05 15.49,6.67 11.11,6.67 8.26,3.81 12VO/P.2 | 31.3,9.72 v31.3,9.14
  Bottom 0.229: v66.74,26.86 63.12,23.24 63.12,8.38 62.55,7.81 v61.79,7.81 | v56.45,6.67 56.07,6.29 53.21,6.29 v52.83,6.67 | v31.3,9.14 25.97,3.81 EXTRA12V.2
N$23  (via drill 0.35)
  Top 0.229: v95.31,47.82 96.46,47.82 v97.79,46.48 | v101.98,42.29 102.74,41.53 103.5,41.53 103.89,41.91 113.6,41.91 v118.74,36.77 | v134.56,27.05 v129.6,32
  Bottom 0.229: v95.31,47.82 89.98,53.15 87.5,53.15 86.55,54.1 86.55,54.67 85.22,56.01 85.22,57.15 PI.20 | v101.98,42.29 v97.79,46.48 | v118.74,36.77 119.89,35.62 119.89,34.48 123.89,30.48 126.17,30.48 127.32,31.62 129.22,31.62 v129.6,32 | v134.56,27.05 134.94,27.05 141.6,20.38 145.41,20.38 150.56,15.24 HEADER1.7
N$24  (via drill 0.35)
  Top 0.229: v101.79,53.15 113.98,53.15 119.51,47.62 119.51,35.81 v119.13,35.43 | v163.7,30.29 165.99,28 166.37,28 HEADER1.2
  Bottom 0.229: PI.30 97.79,56.2 99.12,54.86 99.12,54.29 100.27,53.15 v101.79,53.15 | v119.13,35.43 119.51,35.05 119.51,34.29 123.7,30.1 126.36,30.1 127.51,31.24 141.22,31.24 143.7,33.72 145.41,33.72 146.37,32.77 157.23,32.77 157.61,33.15 160.84,33.15 v163.7,30.29
N$25
  Bottom 0.229: PI.28 95.31,57.15 95.31,56.01 96.65,54.67 96.65,54.29 96.84,54.1 96.84,51.24 96.46,50.86 96.46,50.1 97.79,48.77 100.65,48.77 102.93,46.48 104.27,46.48 109.41,41.34 109.41,39.81 109.03,39.43 109.03,39.05 109.98,38.1 120.46,38.1 122.94,40.58 129.79,40.58 130.94,41.72 139.51,41.72 140.65,40.58 158.75,40.58 163.7,35.62 163.7,32.77 164.47,32 164.47,27.05 165.99,25.53 166.37,25.53 HEADER1.3
N$26  (via drill 0.35)
  Top 0.229: v96.08,52.2 96.65,51.63 98.36,51.63 98.74,52.01 v99.5,52.01
  Bottom 0.229: v96.08,52.2 94.17,54.1 94.17,54.67 92.84,56.01 92.84,57.15 PI.26 | v99.5,52.01 100.65,50.86 100.65,50.48 102.74,48.39 103.5,48.39 110.17,41.72 110.17,40.2 110.74,39.62 120.84,39.62 122.17,40.96 129.6,40.96 130.75,42.1 139.7,42.1 140.84,40.96 158.94,40.96 164.08,35.81 164.08,32.96 165.42,31.62 167.51,31.62 168.47,30.67 168.47,24.57 166.75,22.86 HEADER1.4
N$27  (via drill 0.35)
  Top 0.229: v121.6,29.72 127.51,23.81 127.51,16.95 129.79,14.67 134.37,14.67 137.99,11.05 145.22,11.05 146.18,10.1 155.89,10.1 165.99,20.19 166.37,20.19 HEADER1.5
  Bottom 0.229: PI.24 90.17,56.2 91.5,54.86 91.5,54.29 92.27,53.53 93.41,53.53 96.08,50.86 96.08,49.91 97.6,48.39 100.08,48.39 101.6,46.86 101.6,44.77 117.03,29.34 121.22,29.34 v121.6,29.72
N$28  (via drill 0.35)
  Top 0.229: v93.98,51.44 94.17,51.24 v98.93,51.24 | v103.31,44.01 v103.31,47.62 | v122.74,27.43 v120.08,30.1
  Bottom 0.229: v93.98,51.44 93.98,51.82 93.03,52.77 90.93,52.77 90.17,53.53 89.79,53.53 89.03,54.29 89.03,54.67 87.69,56.01 87.69,57.15 PI.22 | v98.93,51.24 99.69,51.24 100.27,50.67 100.27,50.29 102.93,47.62 v103.31,47.62 | v103.31,44.01 103.31,43.62 117.22,29.72 119.7,29.72 v120.08,30.1 | v122.74,27.43 123.13,27.81 134.75,27.81 141.8,20.77 145.61,20.77 150.75,15.62 163.89,15.62 165.99,17.72 166.37,17.72 HEADER1.6
N$29  (via drill 0.35)
  Top 0.229: v81.6,55.63 81.6,55.24 81.41,55.05 81.41,54.29 81.6,54.1 81.6,52.01 v81.98,51.63 | v81.98,49.15 81.03,48.2 81.03,47.05 81.41,46.67 81.41,42.1 v81.03,41.72 | v101.98,40.77 103.89,40.77 104.27,41.15 106.74,41.15 v107.12,40.77 | v163.32,32.19 164.08,31.43 165.04,31.43 165.23,31.62 167.51,31.62 168.47,30.67 168.47,14.48 166.75,12.76 166.37,12.76 HEADER1.8
  Bottom 0.229: PI.18 82.55,56.58 v81.6,55.63 | v81.98,49.15 v81.98,51.63 | v81.03,41.72 81.03,41.34 81.6,40.77 99.5,40.77 100.27,41.53 101.22,41.53 v101.98,40.77 | v107.12,40.77 107.12,40.39 109.79,37.72 120.65,37.72 122.74,39.81 125.03,39.81 125.22,39.62 125.22,39.24 126.36,38.1 127.89,38.1 131.13,41.34 139.32,41.34 140.46,40.2 158.56,40.2 163.32,35.43 v163.32,32.19
N$30
  Top 0.229: PI.16 81.03,57.15 82.36,55.82 82.93,55.82 83.12,55.63 84.65,55.63 84.84,55.82 85.41,55.82 85.6,55.63 87.12,55.63 87.31,55.82 87.88,55.82 88.08,55.63 89.6,55.63 89.79,55.82 90.55,55.82 90.74,55.63 92.27,55.63 92.46,55.82 93.03,55.82 93.22,55.63 94.74,55.63 94.93,55.82 95.5,55.82 95.69,55.63 97.22,55.63 97.41,55.82 98.17,55.82 98.36,55.63 99.88,55.63 100.08,55.82 100.65,55.82 100.84,55.63 102.36,55.63 102.74,56.01 103.31,56.01 103.5,56.2 104.84,56.2 105.22,55.82 105.79,55.82 105.98,55.63 107.51,55.63 107.7,55.82 108.27,55.82 108.46,55.63 109.98,55.63 110.36,56.01 110.94,56.01 113.03,58.1 164.66,58.1 166.37,56.39 166.37,52.77 166.75,52.39 167.13,52.39 168.85,50.67 168.85,12.38 166.75,10.29 166.37,10.29 HEADER1.9
N$31  (via drill 0.35)
  Top 0.229: v83.69,53.91 85.98,51.63 v86.93,51.63 | v86.55,49.53 86.55,44.58 v91.88,39.24 | v102.55,36.77 102.93,36.77 112.27,27.43 112.27,25.53 111.51,24.77 v111.51,22.1 | v117.03,16.57 127.32,16.57 129.6,14.29 134.18,14.29 137.8,10.67 145.03,10.67 145.99,9.72 157.99,9.72 160.08,7.62 HEADER1.10
  Bottom 0.229: PI.14 78.55,57.15 79.88,55.82 80.26,55.82 81.41,54.67 81.41,54.29 82.17,53.53 83.31,53.53 v83.69,53.91 | v86.93,51.63 86.55,51.24 v86.55,49.53 | v91.88,39.24 92.27,39.24 92.65,39.62 101.6,39.62 102.55,38.67 v102.55,36.77 | v111.51,22.1 111.89,22.1 117.03,16.95 v117.03,16.57
N$32  (via drill 0.35)
  Top 0.229: v73.79,49.15 75.31,47.62 v76.45,47.62 | v100.46,40.77 102.17,39.05 102.17,38.67 113.03,27.81 113.03,12.38 112.27,11.62 112.27,9.72 112.84,9.14 112.84,7.24 114.17,5.91 114.94,5.91 115.7,6.67 119.51,6.67 119.89,7.05 127.7,7.05 133.41,12.76 135.13,12.76 137.6,10.29 144.84,10.29 145.8,9.34 157.8,9.34 159.89,7.24 163.89,7.24 165.99,5.14 166.37,5.14 HEADER1.11
  Bottom 0.229: PI.12 74.93,56.2 73.79,55.05 73.79,54.29 74.93,53.15 74.93,50.29 v73.79,49.15 | v76.45,47.62 75.88,47.05 75.88,44.39 79.31,40.96 80.83,40.96 81.41,40.39 100.08,40.39 v100.46,40.77
N$33  (via drill 0.35)
  Top 0.229: PI.6 67.31,56.2 66.17,55.05 66.17,54.29 67.31,53.15 v67.31,50.1 | v58.93,7.05 59.31,7.43 60.83,7.43 v61.21,7.05 | v63.88,7.05 64.64,7.05 65.98,5.71 67.12,5.71 67.31,5.91 71.12,5.91 v71.69,5.33 | v97.03,7.05 97.03,7.43 98.55,8.95 v110.17,8.95 | v144.84,8.76 145.22,8.76 145.41,8.57 157.42,8.57 158.75,7.24 v158.75,6.86
  Bottom 0.229: v67.31,50.1 65.59,48.39 61.02,48.39 60.64,48.77 60.26,48.77 56.83,45.34 56.83,42.29 57.21,41.91 57.21,38.67 55.5,36.96 55.5,32.38 57.98,29.91 57.98,12 57.02,11.05 57.02,8.95 v58.93,7.05 | v63.88,7.05 v61.21,7.05 | v71.69,5.33 72.26,5.91 80.45,5.91 81.6,7.05 95.12,7.05 95.88,6.29 96.27,6.29 v97.03,7.05 | v110.17,8.95 111.7,7.43 113.6,7.43 118.94,12.76 132.08,12.76 132.84,12 132.84,10.1 134.18,8.76 v144.84,8.76 | v158.75,6.86 161.61,6.86 165.8,2.67 166.37,2.67 HEADER1.12
N$34
  Top 0.229: HEADER2.1 4.25,30.48 6.92,27.81 18.54,27.81 19.69,28.96 22.16,28.96 22.92,28.19 31.11,28.19 44.07,41.15 44.07,42.48 44.64,43.05 45.4,43.05 46.55,44.2 47.12,44.2 49.21,46.29 49.21,47.05 53.4,51.24 57.59,51.24 58.93,52.58 59.12,52.58 61.02,54.48 62.17,54.48 PI.1
N$35  (via drill 0.35)
  Top 0.229: v69.22,53.15 71.31,53.15 72.26,54.1 72.26,54.48 PI.9 | v60.64,51.24 60.26,50.86 59.31,50.86 v53.21,44.77
  Bottom 0.229: v69.22,53.15 67.31,53.15 65.41,51.24 v60.64,51.24 | v53.21,44.77 52.64,44.2 52.64,43.62 52.07,43.05 52.07,42.67 50.74,41.34 50.74,40.77 44.07,34.1 26.54,34.1 25.4,32.96 9.21,32.96 4.25,28 3.87,28 HEADER2.2
N$36  (via drill 0.35)
  Top 0.229: v69.6,45.15 68.45,44.01 68.45,43.24 67.31,42.1 v67.31,38.29 | v59.12,11.62 58.74,11.24 57.59,11.24 56.26,9.91 53.4,9.91 51.69,8.19 42.73,8.19 39.69,11.24 30.93,11.24 30.16,12 30.16,14.48 29.78,14.86 29.78,18.67 21.4,27.05 5.78,27.05 5.21,26.48 4.83,26.48 3.87,25.53 HEADER2.3
  Bottom 0.229: v69.6,45.15 71.69,45.15 75.5,48.96 75.5,49.34 75.31,49.53 75.31,54.1 74.93,54.48 PI.11 | v67.31,38.29 65.98,36.96 65.98,34.1 64.45,32.58 63.31,32.58 58.36,27.62 58.36,12.38 v59.12,11.62
N$37  (via drill 0.35)
  Top 0.229: v69.22,52.2 69.79,52.77 75.88,52.77 76.45,53.34 76.45,53.53 77.41,54.48 PI.13 | v60.64,50.29 60.45,50.48 59.5,50.48 53.97,44.96 53.97,44.39 v53.4,43.81
  Bottom 0.229: v69.22,52.2 68.64,52.77 67.5,52.77 65.59,50.86 61.21,50.86 v60.64,50.29 | v53.4,43.81 52.45,42.86 52.45,42.48 51.12,41.15 51.12,40.01 51.88,39.24 51.88,37.72 52.64,36.96 52.64,23.24 50.55,21.14 45.59,21.14 45.02,20.57 43.12,20.57 42.93,20.38 42.93,18.1 41.59,16.76 30.35,16.76 28.64,15.05 27.3,15.05 25.97,16.38 25.97,16.95 16.83,26.1 7.49,26.1 4.25,22.86 HEADER2.4
N$38  (via drill 0.35)
  Top 0.229: v76.07,51.63 75.69,52.01 72.07,52.01 70.17,50.1 v69.79,50.1 | v57.59,44.96 57.02,44.96 v56.07,44.01 | v53.21,42.1 53.21,42.29 52.45,43.05 49.4,43.05 47.31,40.96 45.59,40.96 38.35,33.72 38.35,32.96 36.45,31.05 35.69,31.05 33.97,29.34 33.97,24 v32.26,22.29
  Bottom 0.229: v76.07,51.63 75.69,52.01 75.69,53.91 76.07,54.29 76.07,54.67 77.22,55.82 77.79,55.82 78.93,54.67 79.88,54.67 PI.15 | v69.79,50.1 69.79,49.53 67.88,47.62 61.02,47.62 60.64,47.24 59.31,47.24 57.59,45.53 v57.59,44.96 | v56.07,44.01 56.07,43.62 55.31,42.86 54.93,42.86 54.17,42.1 v53.21,42.1 | v32.26,22.29 32.26,19.24 28.45,15.43 27.5,15.43 26.35,16.57 26.35,17.14 17.02,26.48 2.54,26.48 1.59,25.53 1.59,22.29 3.68,20.19 HEADER2.5
N$39  (via drill 0.35)
  Top 0.229: v85.6,49.53 86.17,48.96 86.17,41.91 85.41,41.15 85.41,40.77 85.03,40.39 85.03,37.53 84.65,37.15 84.65,36.77 85.22,36.2 85.79,36.2 86.74,35.24 86.74,34.86 85.22,33.34 84.07,33.34 83.88,33.15 81.03,33.15 80.64,33.53 v80.64,33.91 | v62.74,29.72 62.74,28.38 57.98,23.62 54.93,23.62 53.97,24.57 51.88,24.57 51.12,25.34 50.36,25.34 46.36,21.34 35.31,21.34 35.12,21.53 30.16,21.53 v29.78,21.91 | v25.97,19.05 25.02,19.05 24.07,18.1 10.73,18.1 6.16,13.53 6.16,12.76 5.02,11.62 2.54,11.62 1.97,12.19 1.97,13.72 3.49,15.24 HEADER2.7
  Bottom 0.229: PI.19 86.17,53.53 86.17,50.1 v85.6,49.53 | v80.64,33.91 80.26,34.29 76.07,34.29 74.36,32.58 74.36,32.19 72.64,30.48 65.59,30.48 64.83,29.72 v62.74,29.72 | v29.78,21.91 27.3,19.43 26.35,19.43 v25.97,19.05
N$40  (via drill 0.35)
  Top 0.229: PI.21 86.17,53.15 v85.41,53.15 | v77.22,53.15 76.83,53.15 76.07,52.39 70.36,52.39 69.41,51.44 69.02,51.44 68.26,52.2 68.26,53.72 v68.45,53.91 | v39.31,49.72 39.69,49.34 39.69,37.91 30.73,28.96 24.83,28.96 v24.45,29.34 | v20.64,25.53 17.02,25.53 8.83,17.34 8.83,16.76 4.83,12.76 3.87,12.76 HEADER2.8
  Bottom 0.229: v77.22,53.15 v85.41,53.15 | v68.45,53.91 68.07,53.91 67.69,53.53 67.12,53.53 65.21,51.63 61.59,51.63 61.02,52.2 60.64,52.2 59.5,51.05 59.12,51.05 58.55,51.63 58.55,57.53 58.36,57.72 51.88,57.72 49.78,55.63 49.78,52.77 48.83,51.82 45.59,51.82 45.21,51.44 41.02,51.44 v39.31,49.72 | v20.64,25.53 v24.45,29.34
N$41  (via drill 0.35)
  Top 0.229: v93.03,42.48 92.27,41.72 92.27,39.81 92.65,39.43 92.65,39.05 92.08,38.48 v87.31,38.48 | v63.31,33.34 63.69,33.34 64.83,32.19 64.83,25.53 65.21,25.15 65.21,14.86 60.07,9.72 58.36,9.72 57.02,8.38 54.17,8.38 53.59,7.81 53.59,6.48 53.02,5.91 v41.21,5.91
  Bottom 0.229: PI.23 90.17,54.1 91.12,53.15 93.22,53.15 95.69,50.67 95.69,49.72 96.84,48.58 96.84,44.39 94.93,42.48 v93.03,42.48 | v87.31,38.48 86.55,37.72 85.22,37.72 84.65,37.15 84.65,36.77 83.31,35.43 77.02,35.43 75.31,37.15 75.31,37.91 74.74,38.48 68.07,38.48 67.5,39.05 67.12,39.05 65.79,37.72 64.26,37.72 63.5,36.96 63.5,33.53 v63.31,33.34 | v41.21,5.91 33.97,13.14 32.83,13.14 32.07,13.91 31.3,13.91 26.73,9.34 4.64,9.34 HEADER2.9
N$42  (via drill 0.35)
  Top 0.229: v82.55,52.39 PI.17 | v79.5,49.72 79.31,49.91 78.74,49.91 78.55,49.72 75.31,49.72 v74.74,49.15 | v61.41,45.34 61.41,44.96 59.69,43.24 55.5,43.24 v55.12,43.62 | v53.78,42.86 53.21,42.86 52.64,43.43 46.93,43.43 37.21,33.72 v37.21,33.34 | v19.3,26.29 18.92,25.91 16.83,25.91 8.64,17.72 3.87,17.72 HEADER2.6
  Bottom 0.229: v82.55,52.39 80.83,52.39 80.26,51.82 80.26,50.48 v79.5,49.72 | v74.74,49.15 74.74,48.77 71.5,45.53 70.17,45.53 68.83,46.86 63.12,46.86 61.59,45.34 v61.41,45.34 | v55.12,43.62 54.36,42.86 v53.78,42.86 | v37.21,33.34 36.83,33.72 26.73,33.72 v19.3,26.29
N$43  (via drill 0.35)
  Top 0.229: v89.79,51.63 92.65,54.48 PI.25 | v59.5,44.01 57.78,45.72 56.64,45.72 56.26,45.34 v55.88,45.34 | v48.07,42.67 48.07,42.29 47.12,41.34 45.4,41.34 37.97,33.91 37.97,33.15 36.26,31.43 34.92,31.43 31.3,27.81 22.73,27.81 21.97,28.57 19.88,28.57 18.73,27.43 5.59,27.43 5.02,26.86 2.54,26.86 1.59,25.91 1.59,9.53 3.49,7.62 HEADER2.10
  Bottom 0.229: v89.79,51.63 86.93,48.77 84.45,48.77 84.07,48.39 75.5,48.39 71.12,44.01 v59.5,44.01 | v55.88,45.34 53.59,45.34 53.4,45.53 50.93,45.53 v48.07,42.67
N$44  (via drill 0.35)
  Top 0.229: PI.27 91.5,50.86 79.12,50.86 78.93,50.67 78.36,50.67 78.17,50.48 74.55,50.48 73.41,51.63 72.26,51.63 69.98,49.34 v68.64,49.34 | v58.36,48.01 v60.45,48.01 | v56.64,49.72 56.64,49.34 53.21,45.91 52.45,45.91 50.36,43.81 46.74,43.81 45.21,42.29 v44.83,42.29 | v38.92,42.29 39.31,41.91 39.31,38.1 30.54,29.34 25.4,29.34 24.64,30.1 20.26,30.1 18.35,28.19 7.11,28.19 5.78,29.53 5.78,30.86 5.02,31.62 2.73,31.62 1.21,30.1 1.21,7.43 3.68,4.95 HEADER2.11
  Bottom 0.229: v68.64,49.34 68.64,48.96 67.69,48.01 v60.45,48.01 | v56.64,49.72 v58.36,48.01 | v38.92,42.29 v44.83,42.29
N$45  (via drill 0.35)
  Top 0.229: v109.79,39.24 109.79,38.86 106.93,36.01 v105.79,36.01 | v73.03,28.19 72.64,27.81 68.64,27.81 v68.07,28.38 | v59.12,27.24 58.55,26.67 57.21,26.67 v56.83,27.05 | v51.31,20.95 35.12,20.95 34.92,21.14 28.83,21.14 v28.45,21.53 | v25.21,19.81 23.88,18.48 12.83,18.48 v12.45,18.86 | v10.92,17.34 10.54,17.34 6.54,13.34 6.54,12.57 5.78,11.81 5.78,4.19 4.25,2.67 3.87,2.67 HEADER2.12
  Bottom 0.229: v109.79,39.24 109.79,41.53 104.46,46.86 103.12,46.86 100.84,49.15 97.98,49.15 97.22,49.91 97.22,53.91 97.79,54.48 PI.29 | v105.79,36.01 105.41,36.01 105.03,35.62 101.22,35.62 93.6,28 92.65,28 92.08,28.57 89.79,28.57 88.46,29.91 74.36,29.91 73.03,28.57 v73.03,28.19 | v68.07,28.38 67.88,28.19 66.55,28.19 65.59,27.24 v59.12,27.24 | v56.83,27.05 54.93,25.15 54.93,23.24 52.64,20.95 v51.31,20.95 | v28.45,21.53 28.45,21.14 27.11,19.81 v25.21,19.81 | v10.92,17.34 v12.45,18.86
N$46  (via drill 0.35)
  Top 0.229: v65.41,50.1 65.41,50.86 64.45,51.82 64.45,53.34 63.69,54.1 63.69,55.05 64.64,56.01 64.64,57.15 PI.4 | v68.64,50.86 68.83,51.05 69.6,51.05 70.17,51.63 v70.74,51.63 | v71.69,46.86 72.07,46.86 74.74,44.2 74.74,43.62 75.88,42.48 76.64,42.48 77.22,41.91 77.22,39.24 82.36,34.1 v84.65,34.1 | v84.65,31.43 85.6,30.48 85.6,25.72 83.5,23.62 83.5,12.19 79.88,8.57 79.5,8.57 77.22,6.29 75.88,6.29 72.26,2.67 HEADER7.5
  Bottom 0.229: v65.41,50.1 66.17,50.86 v68.64,50.86 | v70.74,51.63 70.74,50.67 72.07,49.34 72.07,48.96 72.45,48.58 72.45,47.62 v71.69,46.86 | v84.65,31.43 v84.65,34.1
N$47  (via drill 0.35)
  Top 0.229: v78.55,44.2 77.98,43.62 76.45,43.62 75.88,44.2 75.88,44.77 74.55,46.1 v74.55,46.48
  Bottom 0.229: v78.55,44.2 78.55,46.48 80.07,48.01 84.27,48.01 84.65,48.39 92.84,48.39 94.17,47.05 94.17,46.67 95.12,45.72 HEADER6.8 | v74.55,46.48 74.17,46.48 71.31,43.62 63.12,43.62 61.79,42.29 61.79,41.53 61.02,40.77 IC1.11
N$48
  Top 0.229: HEADER7.6 74.93,4.76 76.07,5.91 77.41,5.91 79.69,8.19 80.07,8.19 86.55,14.67 90.55,14.67 92.46,16.57 92.46,17.34 92.27,17.53 92.27,31.43 92.46,31.62 92.46,32 94.17,33.72 94.17,47.62 95.12,48.58 97.22,48.58 100.27,51.63 100.27,54.48 PI.31
N$49  (via drill 0.35)
  Top 0.229: v109.79,52.39 109.41,52.77 106.17,52.77 101.03,47.62 101.03,47.24 100.27,46.48 98.93,46.48 94.55,42.1 94.55,33.53 92.84,31.81 92.84,31.43 v93.03,31.24 | v63.5,28.57 56.83,21.91 v56.45,21.91
  Bottom 0.229: PI.39 109.79,53.91 v109.79,52.39 | v93.03,31.24 91.12,29.34 90.17,29.34 88.84,30.67 73.98,30.67 73.03,29.72 65.98,29.72 65.21,28.96 63.88,28.96 v63.5,28.57 | v56.45,21.91 56.07,21.53 56.07,18.67 52.83,15.43 49.4,15.43 47.12,13.14 47.12,5.14 49.59,2.67 HEADER5.5
N$50  (via drill 0.35)
  Top 0.229: v110.94,40.39 110.94,39.43 v106.74,35.24 | v93.03,26.29 92.65,25.91 92.65,17.72 92.84,17.53 92.84,16.38 90.74,14.29 86.74,14.29 v79.5,7.05 | v71.12,7.05 70.74,7.05 70.36,6.67 66.93,6.67 66.74,6.48 66.36,6.48 65.59,7.24 65.59,7.81 63.69,9.72 62.55,9.72 61.02,8.19 57.4,8.19 57.21,8 54.36,8 53.97,7.62 53.97,6.29 53.21,5.52 49.78,5.52 46.93,2.67 HEADER5.6
  Bottom 0.229: v110.94,40.39 110.55,40.77 110.55,41.91 108.08,44.39 108.08,54.48 PI.37 | v106.74,35.24 101.41,35.24 94.17,28 94.17,27.43 v93.03,26.29 | v79.5,7.05 79.12,7.43 71.5,7.43 v71.12,7.05
N$51  (via drill 0.35)
  Top 0.229: v105.6,51.24 105.22,51.24 101.41,47.43 101.41,47.05 100.46,46.1 99.12,46.1 94.93,41.91 94.93,32.96 v94.17,32.19 | v91.12,32.19 90.74,32.58 84.45,32.58 84.27,32.38 v75.12,32.38 | v61.98,28.57 61.98,28.19 57.78,24 56.83,24 v56.45,24.38
  Bottom 0.229: v105.6,51.24 105.98,51.63 105.98,53.91 105.41,54.48 PI.35 | v91.12,32.19 v94.17,32.19 | v75.12,32.38 72.83,30.1 65.79,30.1 65.02,29.34 63.31,29.34 62.55,28.57 v61.98,28.57 | v56.45,24.38 55.69,23.62 55.69,18.86 52.64,15.81 49.21,15.81 46.74,13.34 46.74,5.14 44.45,2.86 HEADER5.7
N$52  (via drill 0.35)
  Top 0.229: v104.27,48.58 104.27,44.01 103.31,43.05 101.79,43.05 95.31,36.58 v95.31,27.43 | v73.22,25.72 72.26,26.67 68.83,26.67 68.45,26.29 67.5,26.29 v67.31,26.1 | v63.88,23.05 58.55,23.05 56.83,21.34 v56.83,20.95
  Bottom 0.229: v104.27,48.58 102.93,49.91 102.93,54.48 PI.33 | v95.31,27.43 94.17,26.29 94.17,25.91 93.41,25.15 92.65,25.15 91.5,26.29 90.93,26.29 88.08,29.15 76.64,29.15 v73.22,25.72 | v67.31,26.1 66.55,26.1 63.88,23.43 v63.88,23.05 | v56.83,20.95 57.21,21.34 57.21,24.57 56.26,25.53 55.88,25.53 55.31,24.96 55.31,19.05 52.45,16.19 49.02,16.19 46.36,13.53 46.36,5.33 45.4,4.38 43.5,4.38 41.78,2.67 HEADER5.8
N$53  (via drill 0.35)
  Top 0.229: REG.5.2 133.22,16.38 138.18,11.43 R2.2 R1.1 | v51.88,29.53 52.26,29.15 53.78,29.15 54.55,28.38 59.12,28.38 61.21,30.48 62.93,30.48 64.45,28.96 64.45,25.34 64.83,24.96 64.83,22.67 v64.45,22.29 | v67.12,23.24 68.26,22.1 74.36,22.1 v75.69,23.43 | v85.03,24.19 85.03,23.81 86.55,22.29 86.55,18.86 88.65,16.76 v91.69,16.76
  Bottom 0.229: v51.88,29.53 52.26,29.15 52.26,28 50.93,26.67 C11.1 | v64.45,22.29 66.17,22.29 v67.12,23.24 | v75.69,23.43 77.22,23.43 77.98,24.19 v85.03,24.19 | v91.69,16.76 91.69,17.14 92.27,17.72 104.27,17.72 106.93,15.05 126.36,15.05 129.79,18.48 131.7,18.48 133.22,16.95 133.22,16.57 REG.5.2
N$54  (via drill 0.35)
  Top 0.229: 53.4,19.05 53.4,14.1 C2.2 | 53.4,19.05 53.4,20 50.93,22.48 50.93,24 C11.2 | 53.4,19.05 C1.2 | C4.2 40.64,17.53 | 40.64,17.53 40.64,15.24 | 40.64,15.24 C5.2 | 40.64,17.53 45.4,17.53 46.93,19.05 C3.2 | 40.64,15.24 C10.2 | 23.3,10.29 27.11,14.1 27.88,14.1 C7.2 | 23.3,10.29 19.69,6.67 16.07,6.67 15.68,6.29 14.73,6.29 12.26,3.81 12VO/P.1 | 23.3,10.29 29.78,3.81 EXTRA12V.1 | HEADER3.4 3.68,43.24 1.21,45.72 1.21,52.77 2.92,54.48 SM4.2 3.11,54.67 6.54,58.1 9.78,58.1 13.21,54.67 SM2.2 13.4,54.48 16.07,51.82 24.64,51.82 27.3,54.48 TOBATT..2 27.5,54.67 33.4,54.67 BAT.1.2 33.59,54.67 37.02,58.1 45.78,58.1 | 45.78,58.1 46.36,57.53 46.36,57.15 43.88,54.67 BAT.3.2 | 45.78,58.1 49.02,58.1 52.45,54.67 TOPI.2 | EXTRA3.3V.2 148.08,54.67 155.32,54.67 SM3.2 | HEADER4.4 166.37,40.77 164.47,40.77 162.75,42.48 162.75,52.96 164.27,54.48 SM1.2 | C9.2 68.45,12.76 67.31,13.91 C6.2 67.31,17.91 65.98,19.24 65.98,25.53 65.59,25.91 65.59,34.67 64.83,35.43 IC1.8 | 134.56,9.91 134.56,6.48 R3.1 134.56,6.29 134.56,2.67 R4.1 133.22,1.14 127.89,1.14 125.22,3.81 FROMUSB.1 125.03,3.81 122.17,6.67 120.08,6.67 119.7,6.29 118.94,6.29 116.46,3.81 LED2.1 | 134.56,9.91 134.56,11.43 R2.1 | C8.2 91.31,10.1 90.74,10.1 84.45,3.81 LED1.2 | v85.98,35.05 85.22,35.81 85.03,35.81 84.27,36.58 84.27,37.34 84.65,37.72 84.65,40.58 85.03,40.96 85.03,41.34 85.79,42.1 85.79,45.15 85.22,45.72 HEADER6.4 | v85.98,31.43 85.98,23.43 86.93,22.48 86.93,20.95 87.5,20.38 REG.4.2 | v109.98,13.91 109.98,15.43 105.41,20 REG.2.2 | v162.94,6.48 162.56,6.86 159.7,6.86 157.61,8.95 145.61,8.95 144.65,9.91 134.56,9.91 | v57.98,5.91 64.26,5.91 67.31,2.86 HEADER7.3
  Bottom 0.229: 52.07,5.91 52.07,11.62 52.83,12.38 52.83,13.53 53.21,13.91 C2.2 | 52.07,5.91 HEADER5.4 | C7.2 28.64,14.67 28.83,14.67 29.4,15.24 C10.2 | TOXL6009.1 40.07,3.81 42.16,5.91 42.16,11.05 40.64,12.57 C5.2 | C1.2 53.4,19.05 53.4,17.72 52.26,16.57 49.59,16.57 47.12,19.05 C3.2 | HEADER3.4 3.11,42.48 2.54,42.48 1.21,41.15 1.21,10.48 2.73,8.95 6.92,8.95 12.06,3.81 12VO/P.1 | BAT.2.2 120.08,54.67 123.13,57.72 125.03,57.72 130.75,52.01 130.75,51.63 131.32,51.05 131.7,51.05 132.46,51.82 132.46,54.48 BAT.4.2 132.65,54.67 135.7,57.72 144.84,57.72 147.89,54.67 EXTRA3.3V.2 | SM3.2 155.51,54.67 158.56,57.72 161.23,57.72 164.27,54.67 SM1.2 | 67.31,4.38 67.31,8.38 69.22,10.29 69.22,12 68.64,12.57 C9.2 | 67.31,4.38 HEADER7.3 | 96.84,20 98.36,18.48 103.69,18.48 105.41,20.19 REG.2.2 | 96.84,20 REG.3.2 96.65,20.19 | 87.5,20 87.69,20.19 REG.4.2 87.5,20 | 87.5,20 85.98,18.48 80.45,18.48 78.74,20.19 REG.1.2 | v85.98,31.43 v85.98,35.05 | 96.84,20 95.31,18.48 91.88,18.48 | 91.88,18.48 89.03,18.48 87.5,20 | C8.2 89.98,11.62 89.98,16.57 91.88,18.48 | R2.1 133.99,11.43 131.13,14.29 110.36,14.29 v109.98,13.91 | 67.31,4.38 83.69,4.38 84.27,3.81 LED1.2 | v162.94,6.48 165.23,8.76 167.32,8.76 168.85,10.29 168.85,38.48 166.75,40.58 166.37,40.58 HEADER4.4 | v57.98,5.91 52.07,5.91
N$55  (via drill 0.35)
  Top 0.229: R3.2 R4.2 | IC1.15 55.88,40.2 57.98,38.1 v63.69,38.1 | v112.27,24.57 112.27,24.96 112.65,25.34 112.65,27.62 v101.41,38.86
  Bottom 0.229: v63.69,38.1 64.83,39.24 64.83,42.1 65.59,42.86 72.07,42.86 | 72.07,42.86 73.6,41.34 73.6,40.77 IC1.1 | R3.2 147.32,8 136.46,18.86 116.27,18.86 112.27,22.86 v112.27,24.57 | v101.41,38.86 101.03,39.24 92.84,39.24 92.08,38.48 91.5,38.48 90.36,39.62 81.03,39.62 80.45,40.2 78.93,40.2 76.26,42.86 72.07,42.86
N$57  (via drill 0.35)
  Top 0.229: v62.93,31.24 62.55,30.86 61.02,30.86 58.93,28.77 57.59,28.77 v57.21,29.15 | v53.4,10.67 53.4,10.48 51.5,8.57 42.93,8.57 41.4,10.1 v41.4,10.48 | v38.73,10.48 38.35,10.86 32.45,10.86 v32.07,10.48
  Bottom 0.229: v62.93,31.24 62.93,31.62 63.5,32.19 64.64,32.19 65.59,33.15 70.55,33.15 72.26,34.86 72.26,35.43 IC1.2 | v57.21,29.15 57.59,28.77 57.59,14.86 v53.4,10.67 | v38.73,10.48 v41.4,10.48 | v32.07,10.48 28.45,10.48 26.92,8.95 26.35,8.95 21.21,3.81 MOTOR2.1
N$58  (via drill 0.35)
  Top 0.229: IC1.3 71.12,45.53 v70.36,46.29 | v62.17,46.86 62.17,45.15 59.88,42.86 55.5,42.86 53.78,41.15 53.78,40.77 52.64,39.62 v50.55,39.62 | v21.97,25.53 22.35,25.53 27.69,20.19 27.69,18.86 27.11,18.29 26.73,18.29 26.16,17.72 26.16,14.29 19.69,7.81 v19.3,7.81
  Bottom 0.229: v70.36,46.29 69.98,46.29 69.02,47.24 62.55,47.24 v62.17,46.86 | v50.55,39.62 50.17,39.62 44.26,33.72 38.54,33.72 29.97,25.15 22.35,25.15 v21.97,25.53 | v19.3,7.81 19.3,5.91 17.21,3.81 MOTOR2.2
N$59  (via drill 0.35)
  Top 0.229: v68.83,45.91 68.83,46.29 69.79,47.24 70.36,47.24 71.5,46.1 72.26,46.1 74.36,44.01 74.36,43.43 75.69,42.1 76.45,42.1 76.83,41.72 76.83,39.05 79.88,36.01 79.88,33.72 80.83,32.77 84.07,32.77 84.27,32.96 91.31,32.96 92.08,32.19 92.08,31.81 91.88,31.62 91.88,25.53 v91.5,25.15 | v108.46,23.81 109.98,23.81 v110.74,23.05 | v129.99,19.62 v128.46,18.1
  Bottom 0.229: v68.83,45.91 67.31,44.39 61.41,44.39 61.02,44.77 59.31,44.77 58.55,44.01 58.55,40.77 IC1.13 | v91.5,25.15 93.22,23.43 108.08,23.43 v108.46,23.81 | v110.74,23.05 111.51,23.05 116.08,18.48 128.08,18.48 v128.46,18.1 | v129.99,19.62 130.37,19.24 136.65,19.24 148.08,7.81 151.32,7.81 155.32,3.81 MOTOR1.1
N$60
  Bottom 0.229: IC1.14 57.21,35.62 57.21,36.2 59.5,38.48 61.41,38.48 62.17,39.24 62.17,42.1 63.31,43.24 76.45,43.24 79.12,40.58 80.64,40.58 81.22,40.01 101.79,40.01 104.65,37.15 108.65,37.15 116.84,28.96 126.36,28.96 127.89,30.48 141.6,30.48 144.08,32.96 145.03,32.96 145.99,32 152.46,32 165.61,18.86 167.51,18.86 168.47,17.91 168.47,12.57 167.13,11.24 162.18,11.24 157.99,7.05 157.99,5.14 159.32,3.81 MOTOR1.2
N$61  (via drill 0.35)
  Top 0.229: v88.46,41.53 85.41,38.48 v85.41,36.96 | v74.55,37.72 73.79,37.72 73.41,38.1 69.79,38.1 67.31,35.62 IC1.6
  Bottom 0.229: v88.46,41.53 92.65,45.72 HEADER6.7 | v85.41,36.96 83.5,35.05 76.83,35.05 74.55,37.34 v74.55,37.72